# Altium project Arduino_board.PrjPcb
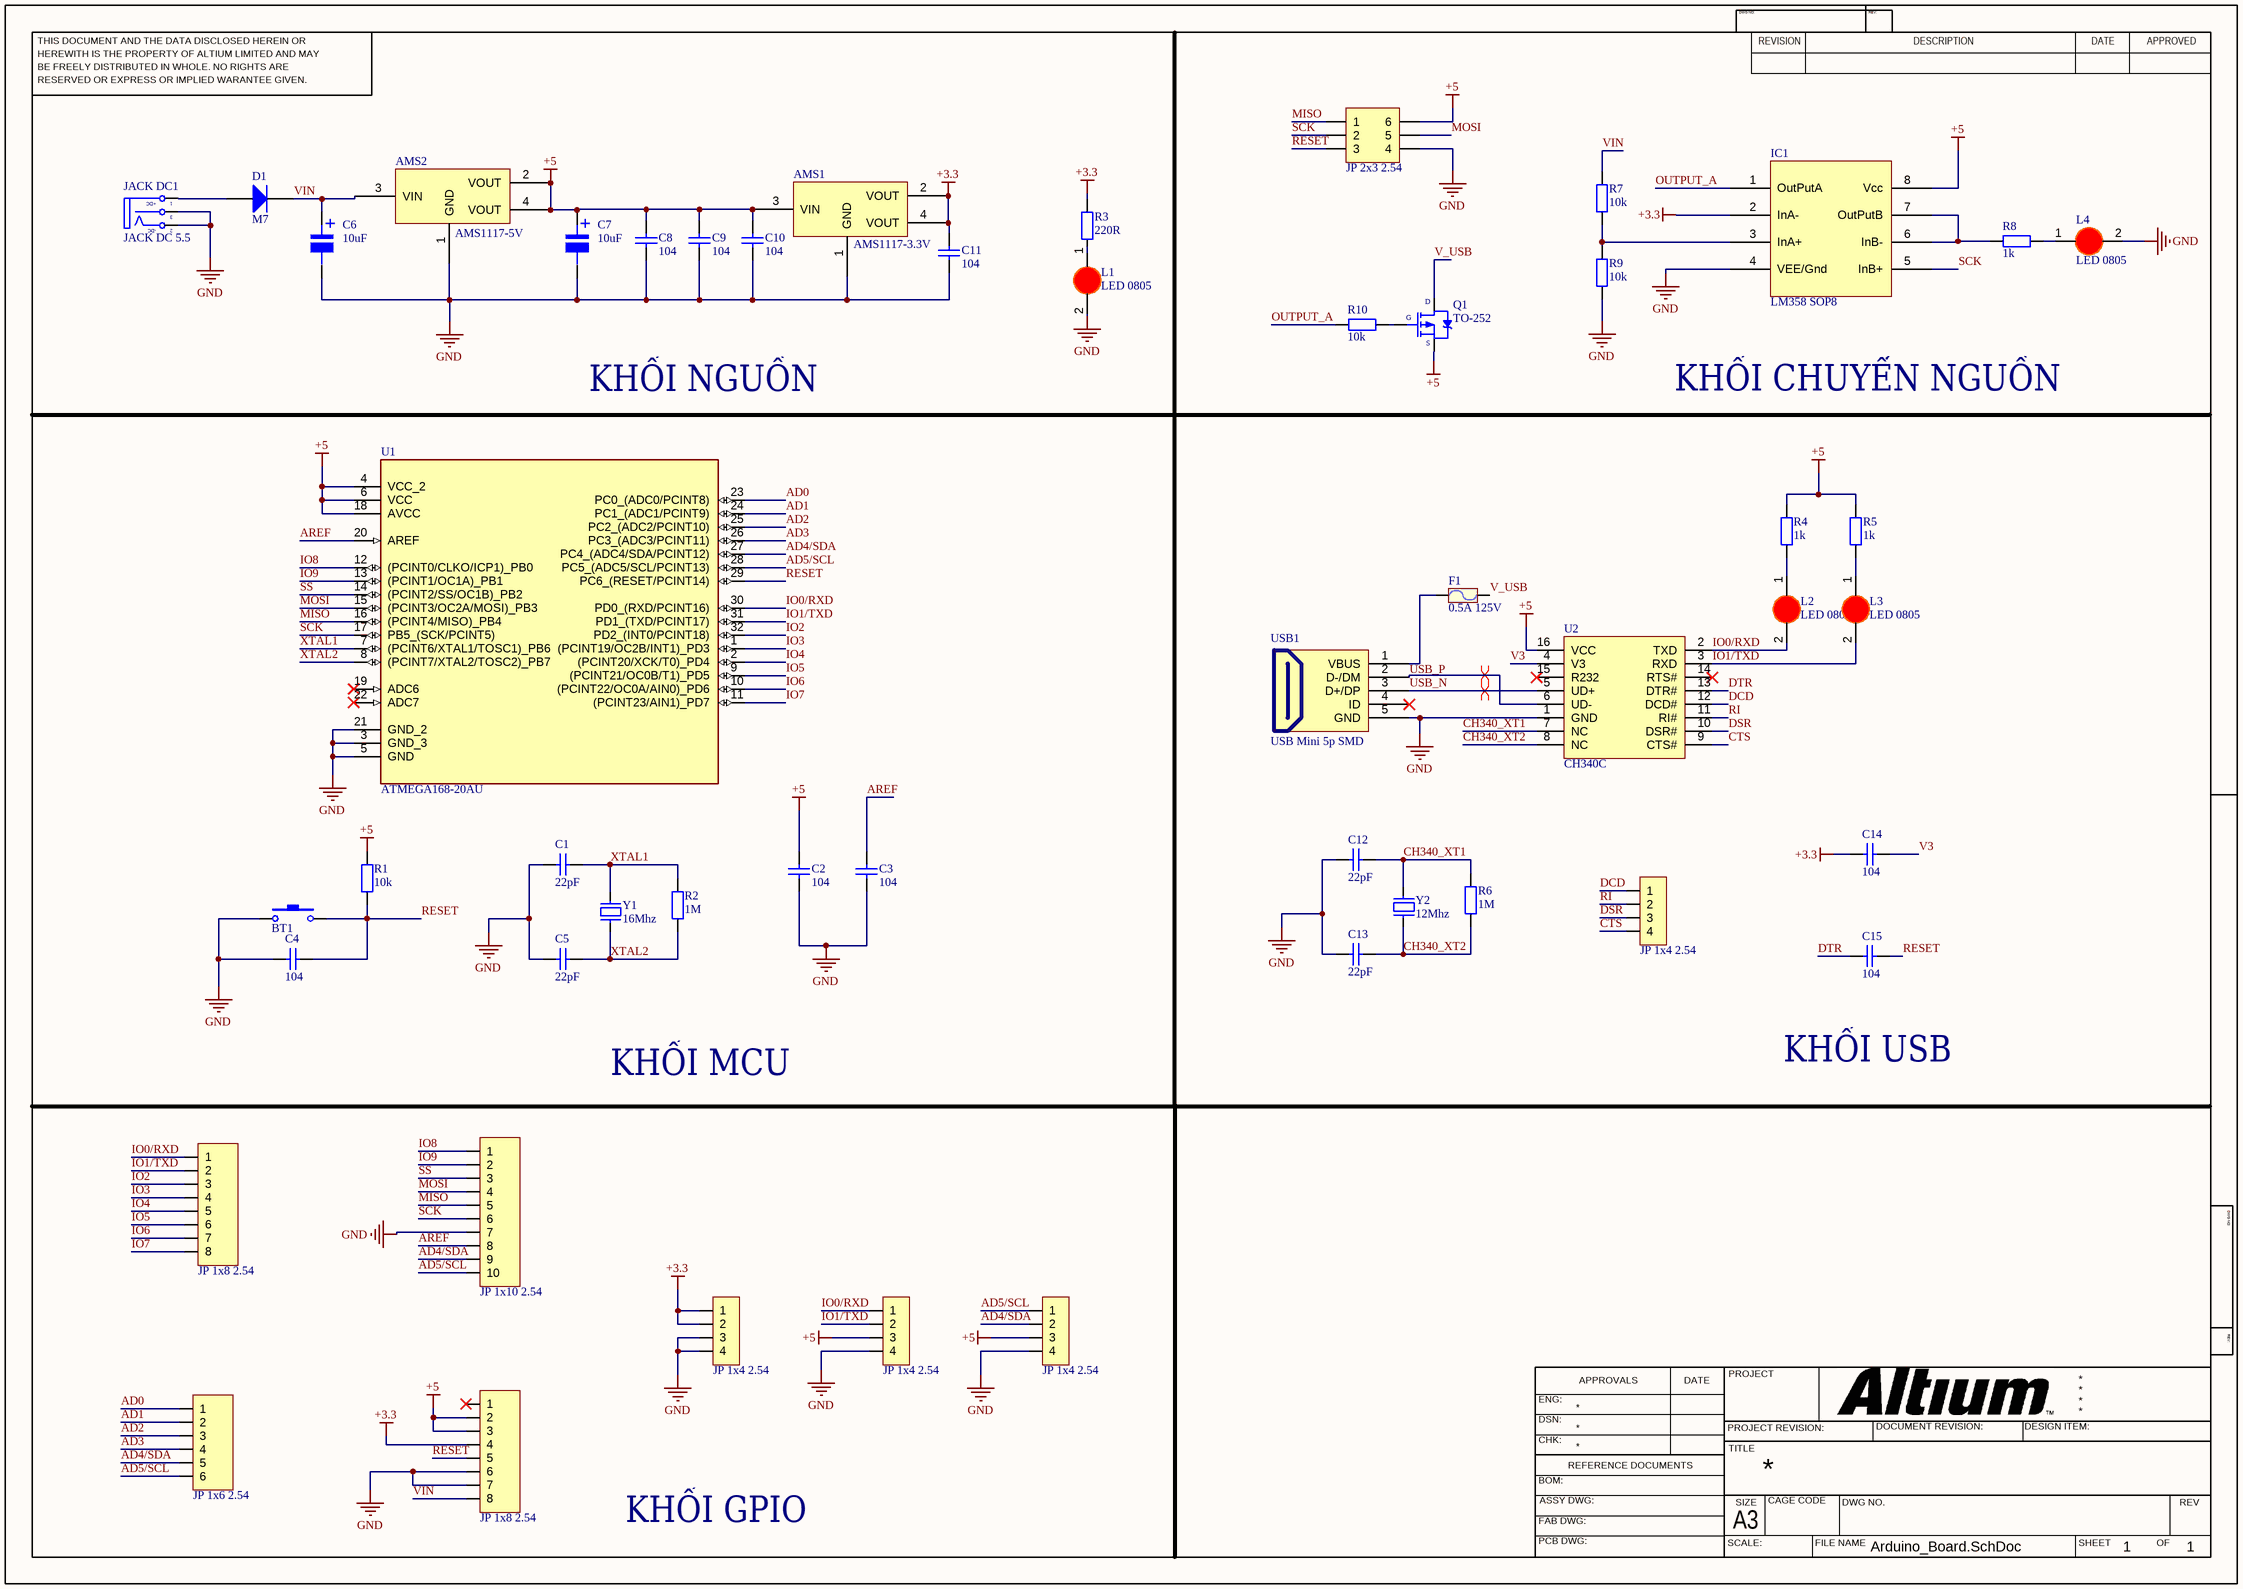
[diagram p0: Arduino_Board.SchDoc]
1 sheet, 51 parts. Net scope: global (net labels, ports and power ports of the same name join across sheets).
Board file: Arduino_Board.PcbDoc

## Sheet Arduino_Board.SchDoc
size 420 x 297 mm; SheetNumber: 1; SheetTotal: 1

### Parts
AMS1  AMS1117-3.3V  [SOT223]
AMS2  AMS1117-5V  [SOT223]
BT1  Nut Nhan 2 Chan SMD 3x6x2.5  [Nut Nhan 2 Chan SMD 3x6x2.5]  (value not drawn)
C1  22pF  [tu 0805]
C2  104  [tu 0805]
C3  104  [tu 0805]
C4  104  [tu 0805]
C5  22pF  [tu 0805]
C6  10uF  [tu nhom 4 (b)]
C7  10uF  [tu nhom 4 (b)]
C8  104  [tu 0805]
C9  104  [tu 0805]
C10  104  [tu 0805]
C11  104  [tu 0805]
C12  22pF  [tu 0805]
C13  22pF  [tu 0805]
C14  104  [tu 0805]
C15  104  [tu 0805]
D1  M7  [DIODE SMA]
F1  0.5A 125V  [Cau Chi SMD1808]
IC1  LM358 SOP8  [SOP 8]
JACK_DC1  JACK DC 5.5  [JACK DC 5.5]
JP1  JP 1x10 2.54  [JP 1x10 CT]
JP2  JP 1x8 2.54  [JP 1x8 CT]
JP3  JP 1x8 2.54  [JP 1x8 CT]
JP4  JP 1x6 2.54  [JP 1x6 CT]
JP5  JP 1x4 2.54  [JP 1x4 CT]
JP6  JP 1x4 2.54  [JP 1x4 CT]
JP7  JP 1x4 2.54  [JP 1x4 CT]
JP8  JP 1x4 2.54  [JP 1x4 CT]
JP9  JP 2x3 2.54  [JP 2x3 DT]
L1  LED 0805  [LED-0805-Red]
L2  LED 0805  [LED-0805-Red]
L3  LED 0805  [LED-0805-Red]
L4  LED 0805  [LED-0805-Red]
Q1  TO-252  [TO-252-3_L6.6-W6.1-P4.57-LS9.9-BR-CW]
R1  10k  [tro smd 0805]
R2  1M  [tro smd 0805]
R3  220R  [tro smd 0805]
R4  1k  [tro smd 0805]
R5  1k  [tro smd 0805]
R6  1M  [tro smd 0805]
R7  10k  [tro smd 0805]
R8  1k  [tro smd 0805]
R9  10k  [tro smd 0805]
R10  10k  [tro smd 0805]
U1  ATMEGA168-20AU  [ATMEGA168]
U2  CH340C  [SOIC16_50_284_25X90_SMT]
USB1  USB Mini 5p SMD  [USB Mini 5p SMD]
Y1  16Mhz  [Thach Anh 2 chan SMD]
Y2  12Mhz  [Thach Anh 2 chan SMD]

### Nets
+3.3: AMS1.2(VOUT) AMS1.4(VOUT) C11.1 C14.1 IC1.2(InA-) JP3.4 JP5.1 JP5.2 R3.2
+5: AMS1.3(VIN) AMS2.2(VOUT) AMS2.4(VOUT) C2.1 C7.1 C8.1 C9.1 C10.1 IC1.8(Vcc) JP3.2 JP3.3 JP6.3 JP7.3 JP9.6 Q1.3(S) R1.2 R4.2 R5.2 U1.4(VCC_2) U1.6(VCC) U1.18(AVCC) U2.16(VCC)
GND: AMS1.1(GND) AMS2.1(GND) BT1.1 C1.2 C2.2 C3.2 C4.2 C5.2 C6.2 C7.2 C8.2 C9.2 C10.2 C11.2 C12.2 C13.2 IC1.4(VEE/Gnd) JACK_DC1.2(TN) JACK_DC1.3(S) JP1.7 JP3.6 JP3.7 JP5.3 JP5.4 JP6.4 JP7.4 JP9.4 L1.2(K) L4.2(K) R9.1 U1.3(GND_3) U1.5(GND) U1.21(GND_2) U2.1(GND) USB1.5(GND)
AD0: JP4.1 U1.23(PC0_(ADC0/PCINT8))
AD1: JP4.2 U1.24(PC1_(ADC1/PCINT9))
AD2: JP4.3 U1.25(PC2_(ADC2/PCINT10))
AD3: JP4.4 U1.26(PC3_(ADC3/PCINT11))
AD4/SDA: JP1.9 JP4.5 JP7.2 U1.27(PC4_(ADC4/SDA/PCINT12))
AD5/SCL: JP1.10 JP4.6 JP7.1 U1.28(PC5_(ADC5/SCL/PCINT13))
AREF: C3.1 JP1.8 U1.20(AREF)
CH340_XT1: C12.1 R6.2 U2.7(NC) Y2.2
CH340_XT2: C13.1 R6.1 U2.8(NC) Y2.1
CTS: JP8.4 U2.9(CTS#)
DCD: JP8.1 U2.12(DCD#)
DSR: JP8.3 U2.10(DSR#)
DTR: C15.1 U2.13(DTR#)
IO0/RXD: JP2.1 JP6.1 L2.2(K) U1.30(PD0_(RXD/PCINT16)) U2.2(TXD)
IO1/TXD: JP2.2 JP6.2 L3.2(K) U1.31(PD1_(TXD/PCINT17)) U2.3(RXD)
IO2: JP2.3 U1.32(PD2_(INT0/PCINT18))
IO3: JP2.4 U1.1((PCINT19/OC2B/INT1)_PD3)
IO4: JP2.5 U1.2((PCINT20/XCK/T0)_PD4)
IO5: JP2.6 U1.9((PCINT21/OC0B/T1)_PD5)
IO6: JP2.7 U1.10((PCINT22/OC0A/AIN0)_PD6)
IO7: JP2.8 U1.11((PCINT23/AIN1)_PD7)
IO8: JP1.1 U1.12((PCINT0/CLKO/ICP1)_PB0)
IO9: JP1.2 U1.13((PCINT1/OC1A)_PB1)
MISO: JP1.5 JP9.1 U1.16((PCINT4/MISO)_PB4)
MOSI: JP1.4 JP9.5 U1.15((PCINT3/OC2A/MOSI)_PB3)
OUTPUT_A: IC1.1(OutPutA) R10.2
RESET: BT1.2 C4.1 C15.2 JP3.5 JP9.3 R1.1 U1.29(PC6_(RESET/PCINT14))
RI: JP8.2 U2.11(RI#)
SCK: IC1.5(InB+) JP1.6 JP9.2 U1.17(PB5_(SCK/PCINT5))
SS: JP1.3 U1.14((PCINT2/SS/OC1B)_PB2)
USB_N: U2.5(UD+) USB1.3(D+/DP)
USB_P: U2.6(UD-) USB1.2(D-/DM)
V3: C14.2 U2.4(V3)
V_USB: F1.2 Q1.2(D)
VIN: AMS2.3(VIN) C6.1 D1.2(K) JP3.8 R7.2
XTAL1: C1.1 R2.2 U1.7((PCINT6/XTAL1/TOSC1)_PB6) Y1.2
XTAL2: C5.1 R2.1 U1.8((PCINT7/XTAL2/TOSC2)_PB7) Y1.1
NetD1_1: D1.1(A) JACK_DC1.1(T)
NetF1_1: F1.1 USB1.1(VBUS)
NetIC1_3: IC1.3(InA+) R7.1 R9.2
NetIC1_6: IC1.6(InB-) IC1.7(OutPutB) R8.2
NetL1_1: L1.1(A) R3.1
NetL2_1: L2.1(A) R4.1
NetL3_1: L3.1(A) R5.1
NetL4_1: L4.1(A) R8.1
NetQ1_1: Q1.1(G) R10.1

Not connected (* = marked no-connect by the designer): JP3 1*; U1 19(ADC6)* 22(ADC7)*; U2 14(RTS#)* 15(R232)*; USB1 4(ID)*

### Layout directives
differential pair: USB_N, USB_P

### Notes on the sheet
- KHỐI NGUỒN
- KHỐI CHUYỂN NGUỒN
- KHỐI USB
- KHỐI MCU
- KHỐI GPIO
- THIS DOCUMENT AND THE DATA DISCLOSED HEREIN OR
- HEREWITH IS THE PROPERTY OF ALTIUM LIMITED AND MAY
- DWG NO:
- REVISION
- REV:
- DESCRIPTION
- DATE
- APPROVED
- BE FREELY DISTRIBUTED IN WHOLE. NO RIGHTS ARE
- RESERVED OR EXPRESS OR IMPLIED WARANTEE GIVEN.
- ENG:
- APPROVALS
- PROJECT
- DSN:
- CHK:
- REFERENCE DOCUMENTS
- PROJECT REVISION:
- TITLE
- DOCUMENT REVISION:
- DESIGN ITEM:
- BOM:
- FAB DWG:
- PCB DWG:
- ASSY DWG:
- SCALE:
- A3
- SIZE
- CAGE CODE
- FILE NAME
- DWG NO.
- SHEET
- OF
- REV
- (in symbol JACK DC 5.5) +DC; -DC
- (in symbol Tu Nhom 10uF 25V) +

### Library data of the parts
AMS1 AMS2 = AMS1117 SMD: Dán; Value: AMS1117-3.3V SOT223; Don_Vi: Con; Ma_Hang: MH000596; Ghi_Chu: *; Kieu_Chan: *; Chung_Loai: Dán
BT1 = Nut Nhan 2 Chan SMD 3x6x2.5: Ma_Hang: MH001036; Ten: Nút Nhấn 2 Chân 3x6x2.5MM SMD
C1 C5 C12 C13 = Tu 0805 22pF 50V 10%: Dán; Don_Vi: Con; So_Chan: 2; Ten_Linh_Kien: Tụ 0805 22P 10% 50V; Ma_Hang: MH004560; Chung_Loai: Dán; Kieu_Chan: *
C2-C4 C8-C11 C14 C15 = Tu 0805 104 50V 10%: Dán; Don_Vi: Con; So_Chan: 2; Ten_Linh_Kien: Tụ 0805 104-100nF 10% 50V; Ma_Hang: MH004551; Chung_Loai: Dán; Kieu_Chan: *
C6 C7 = Tu Nhom 10uF 25V: Dán; Don_Vi: Con; So_Chan: 2; Ten_Linh_Kien: Tụ Nhôm 10uF 25V 4x5MM; Ma_Hang: MH002230; Chung_Loai: Dán; Kieu_Chan: *
D1 = Diode M7 ( 4007 ): Dán; Don_Vi: Con; Ten_Linh_Kien: Diode M7 1N4007 SMD 1A 1000V; Ma_Hang: MH000944; Chung_Loai: Dán; Ghi_Chu: *
F1 = Cau chi 0.5A 125V SMD1808: Ma_Hang: MH009241; Ten: Cầu Chì 0.5A 125V SMD1808 0451.500MRL
IC1 = LM358 SOP8: Dán; Ma_Hang: MH000609; Don_Vi: Con; Ten_Linh_Kien: LM358 SOP8; Kieu_Chan: *; Ghi_Chu: *; Chung_Loai: Dán
JACK_DC1 = JACK DC 5.5: Value: Jac DC
JP1 = JP 1x10 2.54 Cai Thang: Cắm; Ten_Linh_Kien: Jump Đơn Cái 2.54MM 1x20P Thẳng; Don_Vi: Con; Ma_Hang: MH004006; Ghi_Chu: *; Kieu_Chan: *; Chung_Loai: Cắm
JP2 JP3 = JP 1x8 2.54 Cai Thang: Cắm; Ten_Linh_Kien: Jump Đơn Cái 2.54MM 1x20P Thẳng; Don_Vi: Con; Ma_Hang: MH004006; Ghi_Chu: *; Kieu_Chan: *; Chung_Loai: Cắm
JP4 = JP 1x6 2.54 Cai Thang: Cắm; Ten_Linh_Kien: Jump Đơn Cái 2.54MM 1x20P Thẳng; Don_Vi: Con; Ma_Hang: MH004006; Ghi_Chu: *; Kieu_Chan: *; Chung_Loai: Cắm
JP5-JP8 = JP 1x4 2.54 Cai Thang: Cắm; Ten_Linh_Kien: Jump Đơn Cái 2.54MM 1x20P Thẳng; Don_Vi: Con; Ma_Hang: MH004006; Ghi_Chu: *; Kieu_Chan: *; Chung_Loai: Cắm
JP9 = JP 2x3 2.54 Duc Thang: Cắm; Ten_Linh_Kien: Jump Đôi Đực 2.54MM 2x40P Thẳng 11MM; Don_Vi: Con; Ma_Hang: MH002686; Ghi_Chu: *; Kieu_Chan: *; Chung_Loai: Cắm
L1-L4 = LED 0805 Do: Dán; Don_Vi: Con; Ma_Hang: MH000897; Ten_Linh_Kien: LED 0805 Màu Đỏ (Red); Ghi_Chu: *; Kieu_Chan: *; Chung_Loai: Dán
Q1 = FET AO D409: P-Channel Power MOSFET; Note: Pin 2 is electrically connected to pin 4.; Published: 8-Jun-2000; LatestRevisionDate: 17-Jul-2002; LatestRevisionNote: Re-released for DXP Platform.; DatasheetVersion: PD-9.421C; PackageVersion: Feb-1997; PackageReference: TO-220AB; Publisher: Altium Limited; PackageDescription: TO, Thru-Hole, Vertical, Heatsink Mounted; 3 In-Line Leads; Pitch 2.54 mm; ComponentLink1Description: Manufacturer Link; ComponentLink1URL: http://www.irf.com/; ComponentLink2Description: Datasheet; ComponentLink2URL: http://www.irf.com/product-info/datasheets/data/irf9540.pdf
R1 R7 R9 = Tro 0805 1% 10k: Dán; Don_Vi: Con; So_Chan: 2; Ten_Linh_Kien: Trở 0805 1% 10k; Ma_Hang: MH005473; Chung_Loai: Dán; Kieu_Chan: *
R2 R6 = Tro 0805 1% 1M: Dán; Don_Vi: Con; So_Chan: 2; Ten_Linh_Kien: Trở 0805 1% 1M; Ma_Hang: MH005469; Chung_Loai: Dán; Kieu_Chan: *
R3-R5 R8 R10 = Tro 0805 1% 200k: Dán; Don_Vi: Con; So_Chan: 2; Ten_Linh_Kien: Trở 0805 1% 200k; Ma_Hang: MH005483; Chung_Loai: Dán; Kieu_Chan: *
U1 = ATMEGA168-20AU: AVR AVRÂ® ATmega Microcontroller IC 8-Bit 20MHz 16KB _8K x 16_ FLASH 32-TQFP _7x7_; MF: Microchip; MP: ATMEGA168-20AU; Availability: Unavailable; Package: TQFP-32 Microchip; Price: None; SnapEDA_Link: https://www.snapeda.com/parts/ATMEGA168-20AU/Microchip/view-part/776709/?ref=snap; Value: *
U2 = CH340C: USB Bridge, USB to UART USB 2.0 UART Interface; Manufacturer: Olimex; Alternate Part Number-1: NA; Manufacturer Part Number: CH340C; Case/Package: SOIC16; Supplier-1: LCSC; Supplier Part Number-1: C84681
USB1 = USB Mini 5p SMD: USB Type B; Ten: MiniUSB 5P SMD; Ma_Hang: MH001022
Y1 Y2 = Thach Anh 2 chan SMD: Crystal For all Crystal 2pin.; Value: 4Mhz